# Altium schematic sheet Block.SchDoc
size A4
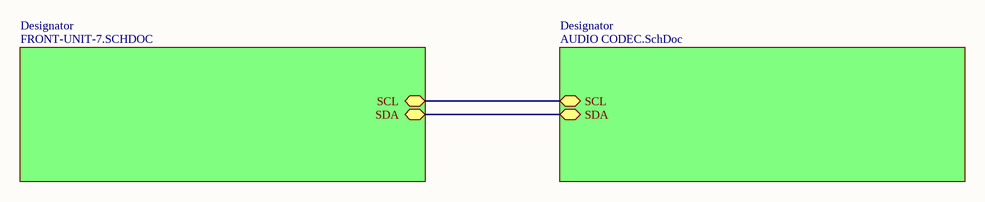
[diagram p0: Block.SchDoc]

## Sub-sheets
Designator = FRONT-UNIT-7.SCHDOC: SCL (bidir), SDA (bidir)
Designator = AUDIO CODEC.SchDoc: SCL (bidir), SDA (bidir)

## Nets
(unnamed): sheet Designator/SCL, sheet Designator/SCL
(unnamed): sheet Designator/SDA, sheet Designator/SDA